# Altium schematic sheet Custom_IMU_testing.SchDoc
size A0; SheetNumber: 1; SheetTotal: 1
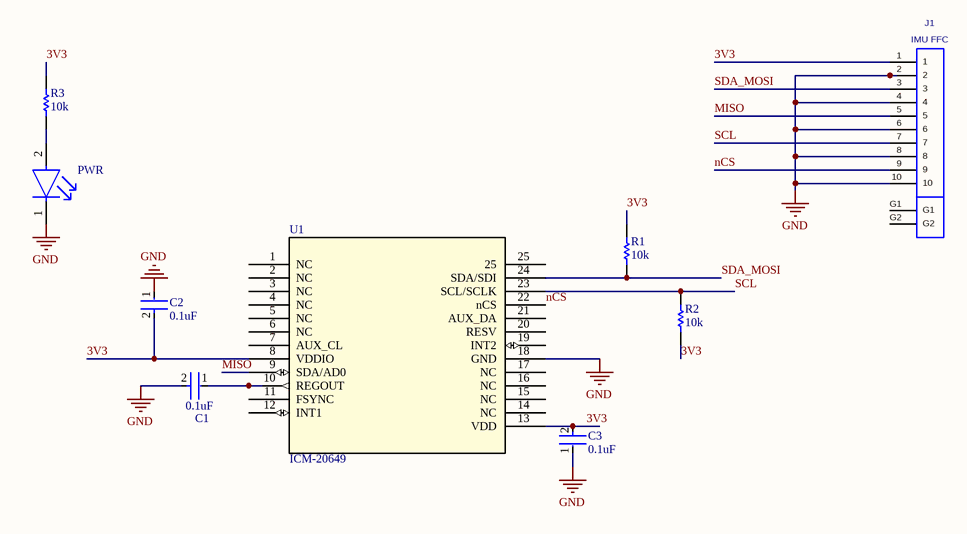
[diagram p0: Custom_IMU_testing.SchDoc]

## Parts
C1  0.1uF  [FP-GRM15-MFG]
C2  0.1uF  [FP-GRM15-MFG]
C3  0.1uF  [FP-GRM15-MFG]
J1  IMU FFC  [ZF5S-10-01-X-WT]
PWR  LTST-C190GKT  [FP-LTST-C190GKT-MFG]  (value not drawn)
R1  10k  [RESC1005X40X25LL05T10]
R2  10k  [RESC1005X40X25LL05T10]
R3  10k  [RESC1005X40X25LL05T10]
U1  ICM-20649  [QFN24_3X3X0P9_IVS]

## Nets
GND: C1.2 C2.1 C3.1 J1.2 J1.4 J1.6 J1.8 J1.10 PWR.1(C) U1.18(GND)
3V3: C2.2 C3.2 J1.1 R1.2 R2.1 R3.2 U1.8(VDDIO) U1.13(VDD)
MISO: J1.5 U1.9(SDA/AD0)
nCS: J1.9 U1.22(nCS)
SCL: J1.7 R2.2 U1.23(SCL/SCLK)
SDA_MOSI: J1.3 R1.1 U1.24(SDA/SDI)
NetC1_1: C1.1 U1.10(REGOUT)
NetPWR_2: PWR.2(A) R3.1

Not connected (* = marked no-connect by the designer): J1 G1 G2; U1 1(NC) 2(NC) 3(NC) 4(NC) 5(NC) 6(NC) 7(AUX_CL) 11(FSYNC) 12(INT1) 14(NC) 15(NC) 16(NC) 17(NC) 19(INT2) 20(RESV) 21(AUX_DA) 25

## Library data of the parts
C1-C3 = CMP-2100-03641-2: CAP CER 0.1UF 16V X7R 0402; Manufacturer Part Number: GRM155R71C104KA88D; Manufacturer: Murata; Standoff Height: 0mm; Tolerance: 10%; Voltage Rating: 16Vdc; Material: Ceramic; Capacitance: 0.10μF; Value: 0.10μF; RoHS: TRUE; Temperature Characteristic: X7R; Octopart: https://octopart.com/grm155r71c104ka88d-murata-196880; Digikey Description: CAP CER 0.1UF 16V X7R 0402; Device Class L3: Ceramic Capacitors; Height: 0.55mm; ComponentLink2Description: Datasheet; Temperature Range Low: -55°C; Ipc Land Pattern Name: CAPC10050X219; ComponentLink2URL: https://search.murata.co.jp/Ceramy/image/img/A01X/G101/ENG/GRM155R71H471KA01-01A.pdf; Device Class L1: Passive Components; Lead Free: yes; Category: Cap; Package: GRM15; Temperature: -55°C to +125°C; Device Class L2: Capacitors; Temperature Range High: +125°C; Mouser Description: 0402 0.1 uF 16V ±10 % Tolerance X7R SMT Multilayer Ceramic Capacitor
J1 = ZF5S-10-01-X-WT: ZERO INSERTION FORCE 0.5MM ASSEMBLY, 01 LEAD STYLE.; MANUFACTURER: SAMTEC; CREATED: January 30, 2015 - Wendy Xin; PCB DECAL: ZF5S-10-01-X-WT
PWR = CMP-22017-000005-2: LED GREEN CLEAR CHIP SMD; Dominant Wavelength: 569nm; Reverse Voltage: 5V; Lens Color: Colorless; Viewing Angle: 130°; Voltage: 2V; Forward Current: 30mA; Power Dissipation: 100mW; Luminous Intensity: 6mcd; Number of LEDs: 1; Forward Voltage: 2.1V; Wavelength: 565nm; Test Current: 10mA; Min Operating Temperature: -55°C; Lens Style: Clear; Mount: Surface Mount; Width: 0.8mm; Packaging: Tape and Reel; Lens Transparency: Clear; Case Code (Metric): 1608; Depth: 0.8mm; Case Code (Imperial): 0603; Case/Package: 0603; Number of Pins: 2; Max Operating Temperature: 85°C; Lead Free: Lead Free; Number of Elements: 1; Length: 1.6mm; Height: 0.8mm; Package Quantity: 1; Power Rating: 100mW; Radiation Hardening: No; Illumination Color: Green; Color: Green
R1-R3 = CMP-2002-07353-1: Part Number: RC0402FR-0710KL; Manufacturer: Yageo / Phycomp
U1 = ICM-20649: No Description Available; Mfr_Name: InvenSense; Copyright: Copyright (C) 2023 Ultra Librarian. All rights reserved.; Manufacturer_Part_Number: ICM-20649; RefDes: RefDes; Type: DEV